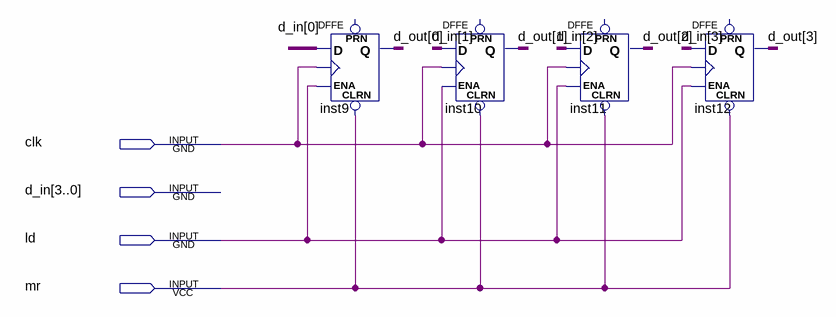
[diagram p0: schematic sheet]
// Quartus schematic reg_4b.bdf as structural Verilog: 4 symbols, 4 pins
module reg_4b (
  input  clk,
  input  [3:0] d_in,
  input  ld,
  input  mr
);

  wire [3:0] d_out;

  DFFE inst9 (.CLRN(mr), .D(d_in[0]), .CLK(clk), .ENA(ld), .Q(d_out[0]));  // open: PRN
  DFFE inst10 (.CLRN(mr), .D(d_in[1]), .CLK(clk), .ENA(ld), .Q(d_out[1]));  // open: PRN
  DFFE inst11 (.CLRN(mr), .D(d_in[2]), .CLK(clk), .ENA(ld), .Q(d_out[2]));  // open: PRN
  DFFE inst12 (.CLRN(mr), .D(d_in[3]), .CLK(clk), .ENA(ld), .Q(d_out[3]));  // open: PRN
endmodule
